# EAGLE design TinyNES_Famicom_Adapter (EAGLE 9.6.2)
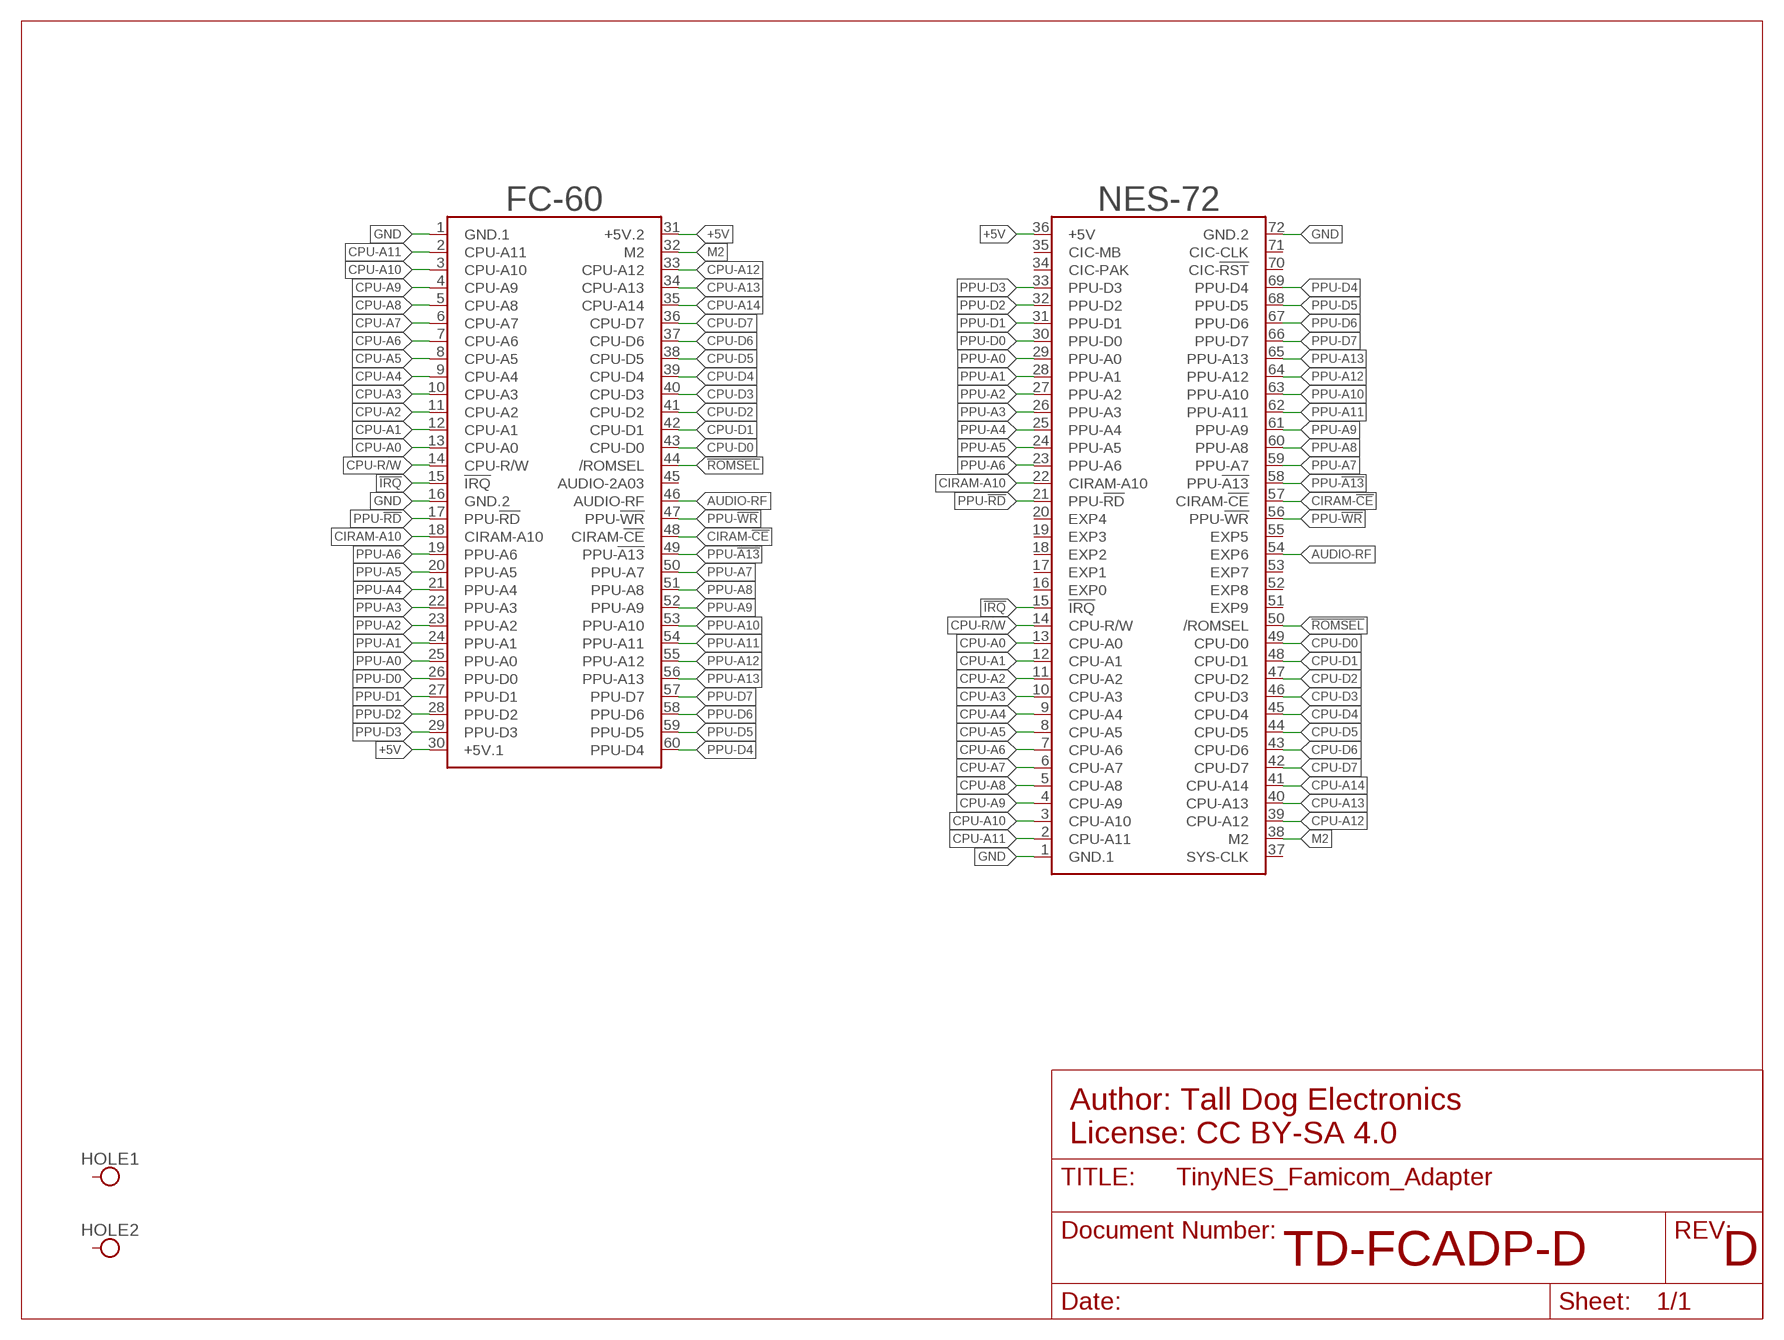
[diagram p0: schematic, sheet 1]

## Parts
FC-60  CART-60-NAMES-CONN-EDGE  [CART-60-2.54-CONN-EDGE]
HOLE1  HOLE-M2.5  [HOLE-M2.5]
HOLE2  HOLE-M2.5  [HOLE-M2.5]
NES-72  CART-72-NAMES-GOLD-FINGERS  [CART-72-2.50-GOLD-FINGERS]

## Nets
!IRQ: FC-60.15(!IRQ) NES-72.15(!IRQ)
!ROMSEL: FC-60.44(/ROMSEL) NES-72.50(/ROMSEL)
+5V: FC-60.30(+5V.1) FC-60.31(+5V.2) NES-72.36(+5V)
AUDIO-RF: FC-60.46(AUDIO-RF) NES-72.54(EXP6)
CIRAM-!CE: FC-60.48(CIRAM-!CE) NES-72.57(CIRAM-!CE)
CIRAM-A10: FC-60.18(CIRAM-A10) NES-72.22(CIRAM-A10)
CPU-A0: FC-60.13(CPU-A0) NES-72.13(CPU-A0)
CPU-A1: FC-60.12(CPU-A1) NES-72.12(CPU-A1)
CPU-A2: FC-60.11(CPU-A2) NES-72.11(CPU-A2)
CPU-A3: FC-60.10(CPU-A3) NES-72.10(CPU-A3)
CPU-A4: FC-60.9(CPU-A4) NES-72.9(CPU-A4)
CPU-A5: FC-60.8(CPU-A5) NES-72.8(CPU-A5)
CPU-A6: FC-60.7(CPU-A6) NES-72.7(CPU-A6)
CPU-A7: FC-60.6(CPU-A7) NES-72.6(CPU-A7)
CPU-A8: FC-60.5(CPU-A8) NES-72.5(CPU-A8)
CPU-A9: FC-60.4(CPU-A9) NES-72.4(CPU-A9)
CPU-A10: FC-60.3(CPU-A10) NES-72.3(CPU-A10)
CPU-A11: FC-60.2(CPU-A11) NES-72.2(CPU-A11)
CPU-A12: FC-60.33(CPU-A12) NES-72.39(CPU-A12)
CPU-A13: FC-60.34(CPU-A13) NES-72.40(CPU-A13)
CPU-A14: FC-60.35(CPU-A14) NES-72.41(CPU-A14)
CPU-D0: FC-60.43(CPU-D0) NES-72.49(CPU-D0)
CPU-D1: FC-60.42(CPU-D1) NES-72.48(CPU-D1)
CPU-D2: FC-60.41(CPU-D2) NES-72.47(CPU-D2)
CPU-D3: FC-60.40(CPU-D3) NES-72.46(CPU-D3)
CPU-D4: FC-60.39(CPU-D4) NES-72.45(CPU-D4)
CPU-D5: FC-60.38(CPU-D5) NES-72.44(CPU-D5)
CPU-D6: FC-60.37(CPU-D6) NES-72.43(CPU-D6)
CPU-D7: FC-60.36(CPU-D7) NES-72.42(CPU-D7)
CPU-R/W: FC-60.14(CPU-R/W) NES-72.14(CPU-R/W)
GND: FC-60.1(GND.1) FC-60.16(GND.2) NES-72.1(GND.1) NES-72.72(GND.2)
M2: FC-60.32(M2) NES-72.38(M2)
PPU-!A13: FC-60.49(PPU-!A13) NES-72.58(PPU-!A13)
PPU-!RD: FC-60.17(PPU-!RD) NES-72.21(PPU-!RD)
PPU-!WR: FC-60.47(PPU-!WR) NES-72.56(PPU-!WR)
PPU-A0: FC-60.25(PPU-A0) NES-72.29(PPU-A0)
PPU-A1: FC-60.24(PPU-A1) NES-72.28(PPU-A1)
PPU-A2: FC-60.23(PPU-A2) NES-72.27(PPU-A2)
PPU-A3: FC-60.22(PPU-A3) NES-72.26(PPU-A3)
PPU-A4: FC-60.21(PPU-A4) NES-72.25(PPU-A4)
PPU-A5: FC-60.20(PPU-A5) NES-72.24(PPU-A5)
PPU-A6: FC-60.19(PPU-A6) NES-72.23(PPU-A6)
PPU-A7: FC-60.50(PPU-A7) NES-72.59(PPU-A7)
PPU-A8: FC-60.51(PPU-A8) NES-72.60(PPU-A8)
PPU-A9: FC-60.52(PPU-A9) NES-72.61(PPU-A9)
PPU-A10: FC-60.53(PPU-A10) NES-72.63(PPU-A10)
PPU-A11: FC-60.54(PPU-A11) NES-72.62(PPU-A11)
PPU-A12: FC-60.55(PPU-A12) NES-72.64(PPU-A12)
PPU-A13: FC-60.56(PPU-A13) NES-72.65(PPU-A13)
PPU-D0: FC-60.26(PPU-D0) NES-72.30(PPU-D0)
PPU-D1: FC-60.27(PPU-D1) NES-72.31(PPU-D1)
PPU-D2: FC-60.28(PPU-D2) NES-72.32(PPU-D2)
PPU-D3: FC-60.29(PPU-D3) NES-72.33(PPU-D3)
PPU-D4: FC-60.60(PPU-D4) NES-72.69(PPU-D4)
PPU-D5: FC-60.59(PPU-D5) NES-72.68(PPU-D5)
PPU-D6: FC-60.58(PPU-D6) NES-72.67(PPU-D6)
PPU-D7: FC-60.57(PPU-D7) NES-72.66(PPU-D7)
Unconnected: FC-60.45(AUDIO-2A03) HOLE1.P$1 HOLE1.P$6 HOLE1.P$7 HOLE1.P$8 HOLE1.P$9 HOLE1.P$13 HOLE1.P$14 HOLE1.P$15 HOLE1.P$16 HOLE2.P$1 HOLE2.P$6 HOLE2.P$7 HOLE2.P$8 HOLE2.P$9 HOLE2.P$13 HOLE2.P$14 HOLE2.P$15 HOLE2.P$16 NES-72.16(EXP0) NES-72.17(EXP1) NES-72.18(EXP2) NES-72.19(EXP3) NES-72.20(EXP4) NES-72.34(CIC-PAK) NES-72.35(CIC-MB) NES-72.37(SYS-CLK) NES-72.51(EXP9) NES-72.52(EXP8) NES-72.53(EXP7) NES-72.55(EXP5) NES-72.70(CIC-!RST) NES-72.71(CIC-CLK)

## Notes on the sheet
- Author: Tall Dog Electronics
  License: CC BY-SA 4.0
- TD-FCADP-D | D

## Library data of the parts
FC-60 = TinyNES_Library:CART-60-NAMES
HOLE1 HOLE2 = TinyNES_Library:HOLE
NES-72 = TinyNES_Library:CART-72-NAMES

## Board
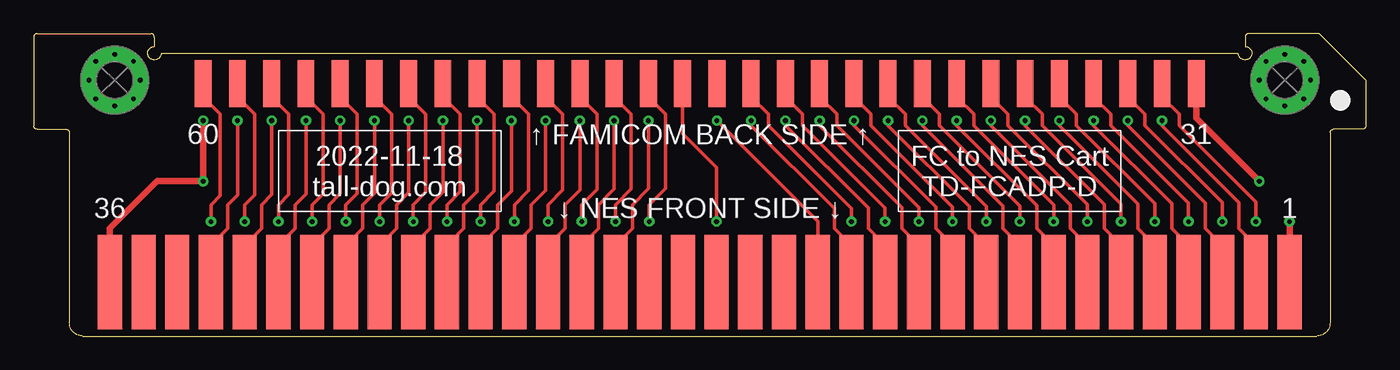
[diagram p1: board, top side]
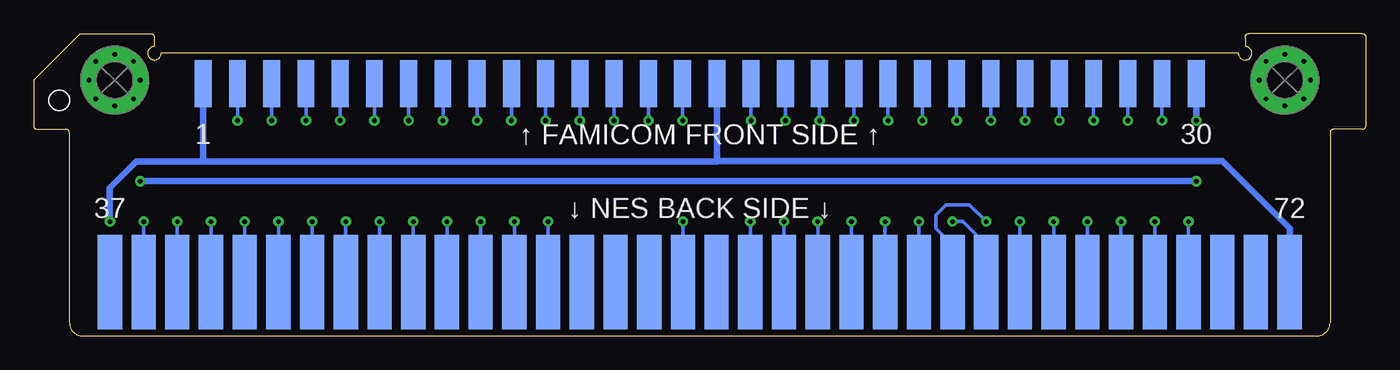
[diagram p2: board, bottom side, seen from below]

Size 98.8 x 22.45 mm. Coordinates in mm from the lower left corner, seen from the top.
Outline: 2.65,7.5 2.65,15.1 arc90 2.4,15.35 0.25,15.35 arc-90 0,15.6 0,22.2 arc-90 0.25,22.45 8.7,22.45 arc-90 8.95,22.2 8.95,21.5 arc270 9.45,21 11.4,21
Outline: 87.4,21 89.35,21 arc270 89.85,21.5 89.85,22.2 arc-90 90.1,22.45 95.35,22.45 98.8,19 98.8,15.6 arc-90 98.55,15.35 96.4,15.35 arc90 96.15,15.1 96.15,7.5
Copper layers (1*16): Top 0.035mm / dielectric 1.5mm / Bottom 0.035mm
Design rules "default *": minimum track width 0.25mm, minimum drill 0.35mm, track to track 15mil, track to pad 15mil, pad to pad 15mil, via to via 15mil, smd to smd 15mil, copper to edge 19mil, drill to drill 14mil, minimum pad ring 10mil, minimum via ring 8mil, stop-mask expansion 0mil, vias tented up to drill 0.35mm, thermal gap 10mil

### Footprints (pad centres in the part's own frame; a part is rotated, then mirrored left to right if it is on the bottom)
CART-60-2.54-CONN-EDGE = smd 1.25 x 3.5: 1 36.83,2.25; 2 34.29,2.25; 3 31.75,2.25; 4 29.21,2.25; 5 26.67,2.25; 6 24.13,2.25; 7 21.59,2.25; 8 19.05,2.25; 9 16.51,2.25; 10 13.97,2.25; 11 11.43,2.25; 12 8.89,2.25; 13 6.35,2.25; 14 3.81,2.25; 15 1.27,2.25; 16 -1.27,2.25; 17 -3.81,2.25; 18 -6.35,2.25; 19 -8.89,2.25; 20 -11.43,2.25; 21 -13.97,2.25; 22 -16.51,2.25; 23 -19.05,2.25; 24 -21.59,2.25; 25 -24.13,2.25; 26 -26.67,2.25; 27 -29.21,2.25; 28 -31.75,2.25; 29 -34.29,2.25; 30 -36.83,2.25 | smd 1.25 x 3.5 bottom: 31 36.83,2.25; 32 34.29,2.25; 33 31.75,2.25; 34 29.21,2.25; 35 26.67,2.25; 36 24.13,2.25; 37 21.59,2.25; 38 19.05,2.25; 39 16.51,2.25; 40 13.97,2.25; 41 11.43,2.25; 42 8.89,2.25; 43 6.35,2.25; 44 3.81,2.25; 45 1.27,2.25; 46 -1.27,2.25; 47 -3.81,2.25; 48 -6.35,2.25; 49 -8.89,2.25; 50 -11.43,2.25; 51 -13.97,2.25; 52 -16.51,2.25; 53 -19.05,2.25; 54 -21.59,2.25; 55 -24.13,2.25; 56 -26.67,2.25; 57 -29.21,2.25; 58 -31.75,2.25; 59 -34.29,2.25; 60 -36.83,2.25
HOLE-M2.5 = drill 2.7 pad 5: P$1 0,0 | drill 0.35: P$6 1.4,1.4; P$7 1.9,0; P$8 1.4,-1.4; P$9 -1.4,-1.4; P$13 0,-1.9; P$14 -1.4,1.4; P$15 -1.9,0; P$16 0,1.9
CART-72-2.50-GOLD-FINGERS = smd 1.8 x 7: 1 43.75,4; 2 41.25,4; 3 38.75,4; 4 36.25,4; 5 33.75,4; 6 31.25,4; 7 28.75,4; 8 26.25,4; 9 23.75,4; 10 21.25,4; 11 18.75,4; 12 16.25,4; 13 13.75,4; 14 11.25,4; 15 8.75,4; 16 6.25,4; 17 3.75,4; 18 1.25,4; 19 -1.25,4; 20 -3.75,4; 21 -6.25,4; 22 -8.75,4; 23 -11.25,4; 24 -13.75,4; 25 -16.25,4; 26 -18.75,4; 27 -21.25,4; 28 -23.75,4; 29 -26.25,4; 30 -28.75,4; 31 -31.25,4; 32 -33.75,4; 33 -36.25,4; 34 -38.75,4; 35 -41.25,4; 36 -43.75,4 | smd 1.8 x 7 bottom: 37 43.75,4; 38 41.25,4; 39 38.75,4; 40 36.25,4; 41 33.75,4; 42 31.25,4; 43 28.75,4; 44 26.25,4; 45 23.75,4; 46 21.25,4; 47 18.75,4; 48 16.25,4; 49 13.75,4; 50 11.25,4; 51 8.75,4; 52 6.25,4; 53 3.75,4; 54 1.25,4; 55 -1.25,4; 56 -3.75,4; 57 -6.25,4; 58 -8.75,4; 59 -11.25,4; 60 -13.75,4; 61 -16.25,4; 62 -18.75,4; 63 -21.25,4; 64 -23.75,4; 65 -26.25,4; 66 -28.75,4; 67 -31.25,4; 68 -33.75,4; 69 -36.25,4; 70 -38.75,4; 71 -41.25,4; 72 -43.75,4

### Placement (x,y rotation side)
FC-60  49.4,21 180 bottom
HOLE1  6,19 0 top
HOLE2  92.8,19 0 top
NES-72  49.4,0 0 top

### Tracks (layer width: path | path; a pad name or v marks a point on that pad's centre or on a via)
!IRQ  (via drill 0.35)
  Top 0.25: NES-72.15 58.15,8.52 v50.67,16
  Bottom 0.25: FC-60.15 v50.67,16
!ROMSEL  (via drill 0.35)
  Top 0.25: FC-60.44 53.21,17.75 54.48,16.48 54.48,15.64 60.65,9.47 v60.65,8.5
  Bottom 0.25: NES-72.50 v60.65,8.5
+5V  (via drill 0.35)
  Top 0.5: v12.57,16 v12.57,11.5 9.15,11.5 5.65,8 NES-72.36 | v90.9,11.5 86.23,16.17 FC-60.31
  Bottom 0.5: v90.9,11.5 v12.57,11.5 | FC-60.30 v12.57,16
AUDIO-RF  (via drill 0.35)
  Top 0.25: FC-60.46 48.13,15.02 50.65,12.5 v50.65,8.5
  Bottom 0.25: NES-72.54 v50.65,8.5
CIRAM-!CE  (via drill 0.35)
  Top 0.25: FC-60.48 43.05,17.75 44.32,16.48 44.32,10.92 43.15,9.75 v43.15,8.5
  Bottom 0.25: NES-72.57 v43.15,8.5
CIRAM-A10  (via drill 0.35)
  Top 0.25: NES-72.22 40.65,6.75 41.9,8 41.9,9.75 43.05,10.9 v43.05,16
  Bottom 0.25: FC-60.18 v43.05,16
CPU-A0  (via drill 0.35)
  Top 0.25: NES-72.13 63.15,6.75 61.9,8 61.9,9.49 55.75,15.64 v55.75,16
  Bottom 0.25: FC-60.13 v55.75,16
CPU-A1  (via drill 0.35)
  Top 0.25: NES-72.12 65.65,6.75 64.4,8 64.4,9.54 58.29,15.64 v58.29,16
  Bottom 0.25: FC-60.12 v58.29,16
CPU-A2  (via drill 0.35)
  Top 0.25: NES-72.11 68.15,6.75 66.9,8 66.9,9.57 60.83,15.64 v60.83,16
  Bottom 0.25: FC-60.11 v60.83,16
CPU-A3  (via drill 0.35)
  Top 0.25: NES-72.10 70.65,6.75 69.4,8 69.4,9.62 63.37,15.64 v63.37,16
  Bottom 0.25: FC-60.10 v63.37,16
CPU-A4  (via drill 0.35)
  Top 0.25: NES-72.9 73.15,6.75 71.9,8 71.9,9.65 65.91,15.64 v65.91,16
  Bottom 0.25: FC-60.9 v65.91,16
CPU-A5  (via drill 0.35)
  Top 0.25: NES-72.8 75.65,6.75 74.4,8 74.4,9.7 68.45,15.64 v68.45,16
  Bottom 0.25: FC-60.8 v68.45,16
CPU-A6  (via drill 0.35)
  Top 0.25: NES-72.7 78.15,6.75 76.9,8 76.9,9.73 70.99,15.64 v70.99,16
  Bottom 0.25: FC-60.7 v70.99,16
CPU-A7  (via drill 0.35)
  Top 0.25: NES-72.6 80.65,6.75 79.4,8 79.4,9.78 73.53,15.64 v73.53,16
  Bottom 0.25: FC-60.6 v73.53,16
CPU-A8  (via drill 0.35)
  Top 0.25: NES-72.5 83.15,6.75 81.9,8 81.9,9.81 76.07,15.64 v76.07,16
  Bottom 0.25: FC-60.5 v76.07,16
CPU-A9  (via drill 0.35)
  Top 0.25: NES-72.4 85.65,6.75 84.4,8 84.4,9.86 78.61,15.64 v78.61,16
  Bottom 0.25: FC-60.4 v78.61,16
CPU-A10  (via drill 0.35)
  Top 0.25: NES-72.3 88.15,6.75 86.9,8 86.9,9.89 81.15,15.64 v81.15,16
  Bottom 0.25: FC-60.3 v81.15,16
CPU-A11  (via drill 0.35)
  Top 0.25: NES-72.2 90.65,6.75 89.4,8 89.4,9.94 83.69,15.64 v83.69,16
  Bottom 0.25: FC-60.2 v83.69,16
CPU-A12  (via drill 0.35)
  Top 0.25: FC-60.33 81.15,17.75 82.42,16.48 82.42,15.64 88.15,9.91 v88.15,8.5
  Bottom 0.25: NES-72.39 v88.15,8.5
CPU-A13  (via drill 0.35)
  Top 0.25: FC-60.34 78.61,17.75 79.88,16.48 79.88,15.64 85.65,9.88 v85.65,8.5
  Bottom 0.25: NES-72.40 v85.65,8.5
CPU-A14  (via drill 0.35)
  Top 0.25: FC-60.35 76.07,17.75 77.34,16.48 77.34,15.64 83.15,9.84 v83.15,8.5
  Bottom 0.25: NES-72.41 v83.15,8.5
CPU-D0  (via drill 0.35)
  Top 0.25: FC-60.43 55.75,17.75 57.02,16.48 57.02,15.64 63.15,9.52 v63.15,8.5
  Bottom 0.25: NES-72.49 v63.15,8.5
CPU-D1  (via drill 0.35)
  Top 0.25: FC-60.42 58.29,17.75 59.56,16.48 59.56,15.64 65.65,9.55 v65.65,8.5
  Bottom 0.25: NES-72.48 v65.65,8.5
CPU-D2  (via drill 0.35)
  Top 0.25: FC-60.41 60.83,17.75 62.1,16.48 62.1,15.64 68.15,9.6 v68.15,8.5
  Bottom 0.25: NES-72.47 v68.15,8.5
CPU-D3  (via drill 0.35)
  Top 0.25: FC-60.40 63.37,17.75 64.64,16.48 64.64,15.64 70.65,9.63 v70.65,8.5
  Bottom 0.25: NES-72.46 v70.65,8.5
CPU-D4  (via drill 0.35)
  Top 0.25: FC-60.39 65.91,17.75 67.18,16.48 67.18,15.64 73.15,9.68 v73.15,8.5
  Bottom 0.25: NES-72.45 v73.15,8.5
CPU-D5  (via drill 0.35)
  Top 0.25: FC-60.38 68.45,17.75 69.72,16.48 69.72,15.64 75.65,9.71 v75.65,8.5
  Bottom 0.25: NES-72.44 v75.65,8.5
CPU-D6  (via drill 0.35)
  Top 0.25: FC-60.37 70.99,17.75 72.26,16.48 72.26,15.64 78.15,9.76 v78.15,8.5
  Bottom 0.25: NES-72.43 v78.15,8.5
CPU-D7  (via drill 0.35)
  Top 0.25: FC-60.36 73.53,17.75 74.8,16.48 74.8,15.64 80.65,9.79 v80.65,8.5
  Bottom 0.25: NES-72.42 v80.65,8.5
CPU-R/W  (via drill 0.35)
  Top 0.25: NES-72.14 60.65,6.75 59.4,8 59.4,9.46 53.21,15.64 v53.21,16
  Bottom 0.25: FC-60.14 v53.21,16
GND  (via drill 0.35)
  Top 0.5: v93.15,8.5 NES-72.1
  Bottom 0.5: FC-60.1 86.23,12.97 | 48.13,13 48.13,12.97 86.23,12.97 | 48.13,13 FC-60.16 | 48.13,13 10.65,13 5.65,8 NES-72.72 | 86.23,12.97 91.18,12.97 93.15,11 v93.15,8.5
M2  (via drill 0.35)
  Top 0.25: FC-60.32 83.69,17.75 84.96,16.48 84.96,15.64 90.65,9.96 v90.65,8.5
  Bottom 0.25: NES-72.38 v90.65,8.5
PPU-!A13  (via drill 0.35)
  Top 0.25: FC-60.49 40.51,17.75 41.78,16.48 41.78,10.88 40.65,9.75 v40.65,8.5
  Bottom 0.25: NES-72.58 v40.65,8.5
PPU-!RD  (via drill 0.35)
  Top 0.25: NES-72.21 43.15,6.75 44.4,8 44.4,9.75 45.59,10.94 v45.59,16
  Bottom 0.25: FC-60.17 v45.59,16
PPU-!WR  (via drill 0.35)
  Top 0.25: FC-60.47 45.59,17.75 46.86,16.48 46.86,10.96 45.65,9.75 v45.65,8.5
  Bottom 0.25: NES-72.56 v45.65,8.5
PPU-A0  (via drill 0.35)
  Top 0.25: NES-72.29 23.15,6.75 24.4,8 24.4,9.75 25.27,10.62 v25.27,16
  Bottom 0.25: FC-60.25 v25.27,16
PPU-A1  (via drill 0.35)
  Top 0.25: NES-72.28 25.65,6.75 26.9,8 26.9,9.75 27.81,10.66 v27.81,16
  Bottom 0.25: FC-60.24 v27.81,16
PPU-A2  (via drill 0.35)
  Top 0.25: NES-72.27 28.15,6.75 29.4,8 29.4,9.75 30.35,10.7 v30.35,16
  Bottom 0.25: FC-60.23 v30.35,16
PPU-A3  (via drill 0.35)
  Top 0.25: NES-72.26 30.65,6.75 31.9,8 31.9,9.75 32.89,10.74 v32.89,16
  Bottom 0.25: FC-60.22 v32.89,16
PPU-A4  (via drill 0.35)
  Top 0.25: NES-72.25 33.15,6.75 34.4,8 34.4,9.75 35.43,10.78 v35.43,16
  Bottom 0.25: FC-60.21 v35.43,16
PPU-A5  (via drill 0.35)
  Top 0.25: NES-72.24 35.65,6.75 36.9,8 36.9,9.75 37.97,10.82 v37.97,16
  Bottom 0.25: FC-60.20 v37.97,16
PPU-A6  (via drill 0.35)
  Top 0.25: NES-72.23 38.15,6.75 39.4,8 39.4,9.75 40.51,10.86 v40.51,16
  Bottom 0.25: FC-60.19 v40.51,16
PPU-A7  (via drill 0.35)
  Top 0.25: FC-60.50 37.97,17.75 39.24,16.48 39.24,10.84 38.15,9.75 v38.15,8.5
  Bottom 0.25: NES-72.59 v38.15,8.5
PPU-A8  (via drill 0.35)
  Top 0.25: FC-60.51 35.43,17.75 36.7,16.48 36.7,10.8 35.65,9.75 v35.65,8.5
  Bottom 0.25: NES-72.60 v35.65,8.5
PPU-A9  (via drill 0.35)
  Top 0.25: FC-60.52 32.89,17.75 34.16,16.48 34.16,10.76 33.15,9.75 v33.15,8.5
  Bottom 0.25: NES-72.61 v33.15,8.5
PPU-A10  (via drill 0.35)
  Top 0.25: FC-60.53 30.35,17.75 31.62,16.48 31.62,10.72 30.65,9.75 v30.65,8.5
  Bottom 0.25: NES-72.63 28.15,6.75 29.9,8.5 v30.65,8.5
PPU-A11  (via drill 0.35)
  Top 0.25: FC-60.54 27.81,17.75 29.08,16.48 29.08,10.68 28.15,9.75 v28.15,8.5
  Bottom 0.25: NES-72.62 30.65,6.75 31.9,8 31.9,9 31.15,9.75 29.4,9.75 v28.15,8.5
PPU-A12  (via drill 0.35)
  Top 0.25: FC-60.55 25.27,17.75 26.54,16.48 26.54,10.64 25.65,9.75 v25.65,8.5
  Bottom 0.25: NES-72.64 v25.65,8.5
PPU-A13  (via drill 0.35)
  Top 0.25: FC-60.56 22.73,17.75 24,16.48 24,10.6 23.15,9.75 v23.15,8.5
  Bottom 0.25: NES-72.65 v23.15,8.5
PPU-D0  (via drill 0.35)
  Top 0.25: NES-72.30 20.65,6.75 21.9,8 21.9,9.75 22.73,10.58 v22.73,16
  Bottom 0.25: FC-60.26 v22.73,16
PPU-D1  (via drill 0.35)
  Top 0.25: NES-72.31 18.15,6.75 19.4,8 19.4,9.75 20.19,10.54 v20.19,16
  Bottom 0.25: FC-60.27 v20.19,16
PPU-D2  (via drill 0.35)
  Top 0.25: NES-72.32 15.65,6.75 16.9,8 16.9,9.75 17.65,10.5 v17.65,16
  Bottom 0.25: FC-60.28 v17.65,16
PPU-D3  (via drill 0.35)
  Top 0.25: NES-72.33 13.15,6.75 14.4,8 14.4,9.75 15.11,10.46 v15.11,16
  Bottom 0.25: FC-60.29 v15.11,16
PPU-D4  (via drill 0.35)
  Top 0.25: v13.15,8.5 13.15,9.75 13.84,10.44 13.84,16.48 12.57,17.75 FC-60.60
  Bottom 0.25: NES-72.69 v13.15,8.5
PPU-D5  (via drill 0.35)
  Top 0.25: FC-60.59 15.11,17.75 16.38,16.48 16.38,10.48 15.65,9.75 v15.65,8.5
  Bottom 0.25: NES-72.68 v15.65,8.5
PPU-D6  (via drill 0.35)
  Top 0.25: FC-60.58 17.65,17.75 18.92,16.48 18.92,10.52 18.15,9.75 v18.15,8.5
  Bottom 0.25: NES-72.67 v18.15,8.5
PPU-D7  (via drill 0.35)
  Top 0.25: FC-60.57 20.19,17.75 21.46,16.48 21.46,10.56 20.65,9.75 v20.65,8.5
  Bottom 0.25: NES-72.66 v20.65,8.5

### Text on the board
tPlace: 60 | ↑ FAMICOM BACK SIDE ↑ | 31 | 2022-11-18 / tall-dog.com | FC to NES Cart / TD-FCADP-D | 36 | ↓ NES FRONT SIDE ↓ | 1
bPlace: 30 | ↑ FAMICOM FRONT SIDE ↑ | 1 | 72 | ↓ NES BACK SIDE ↓ | 37